# EasyEDA Pro project Smart Coaster_rev1.epro, board Smart Coaster Rev1
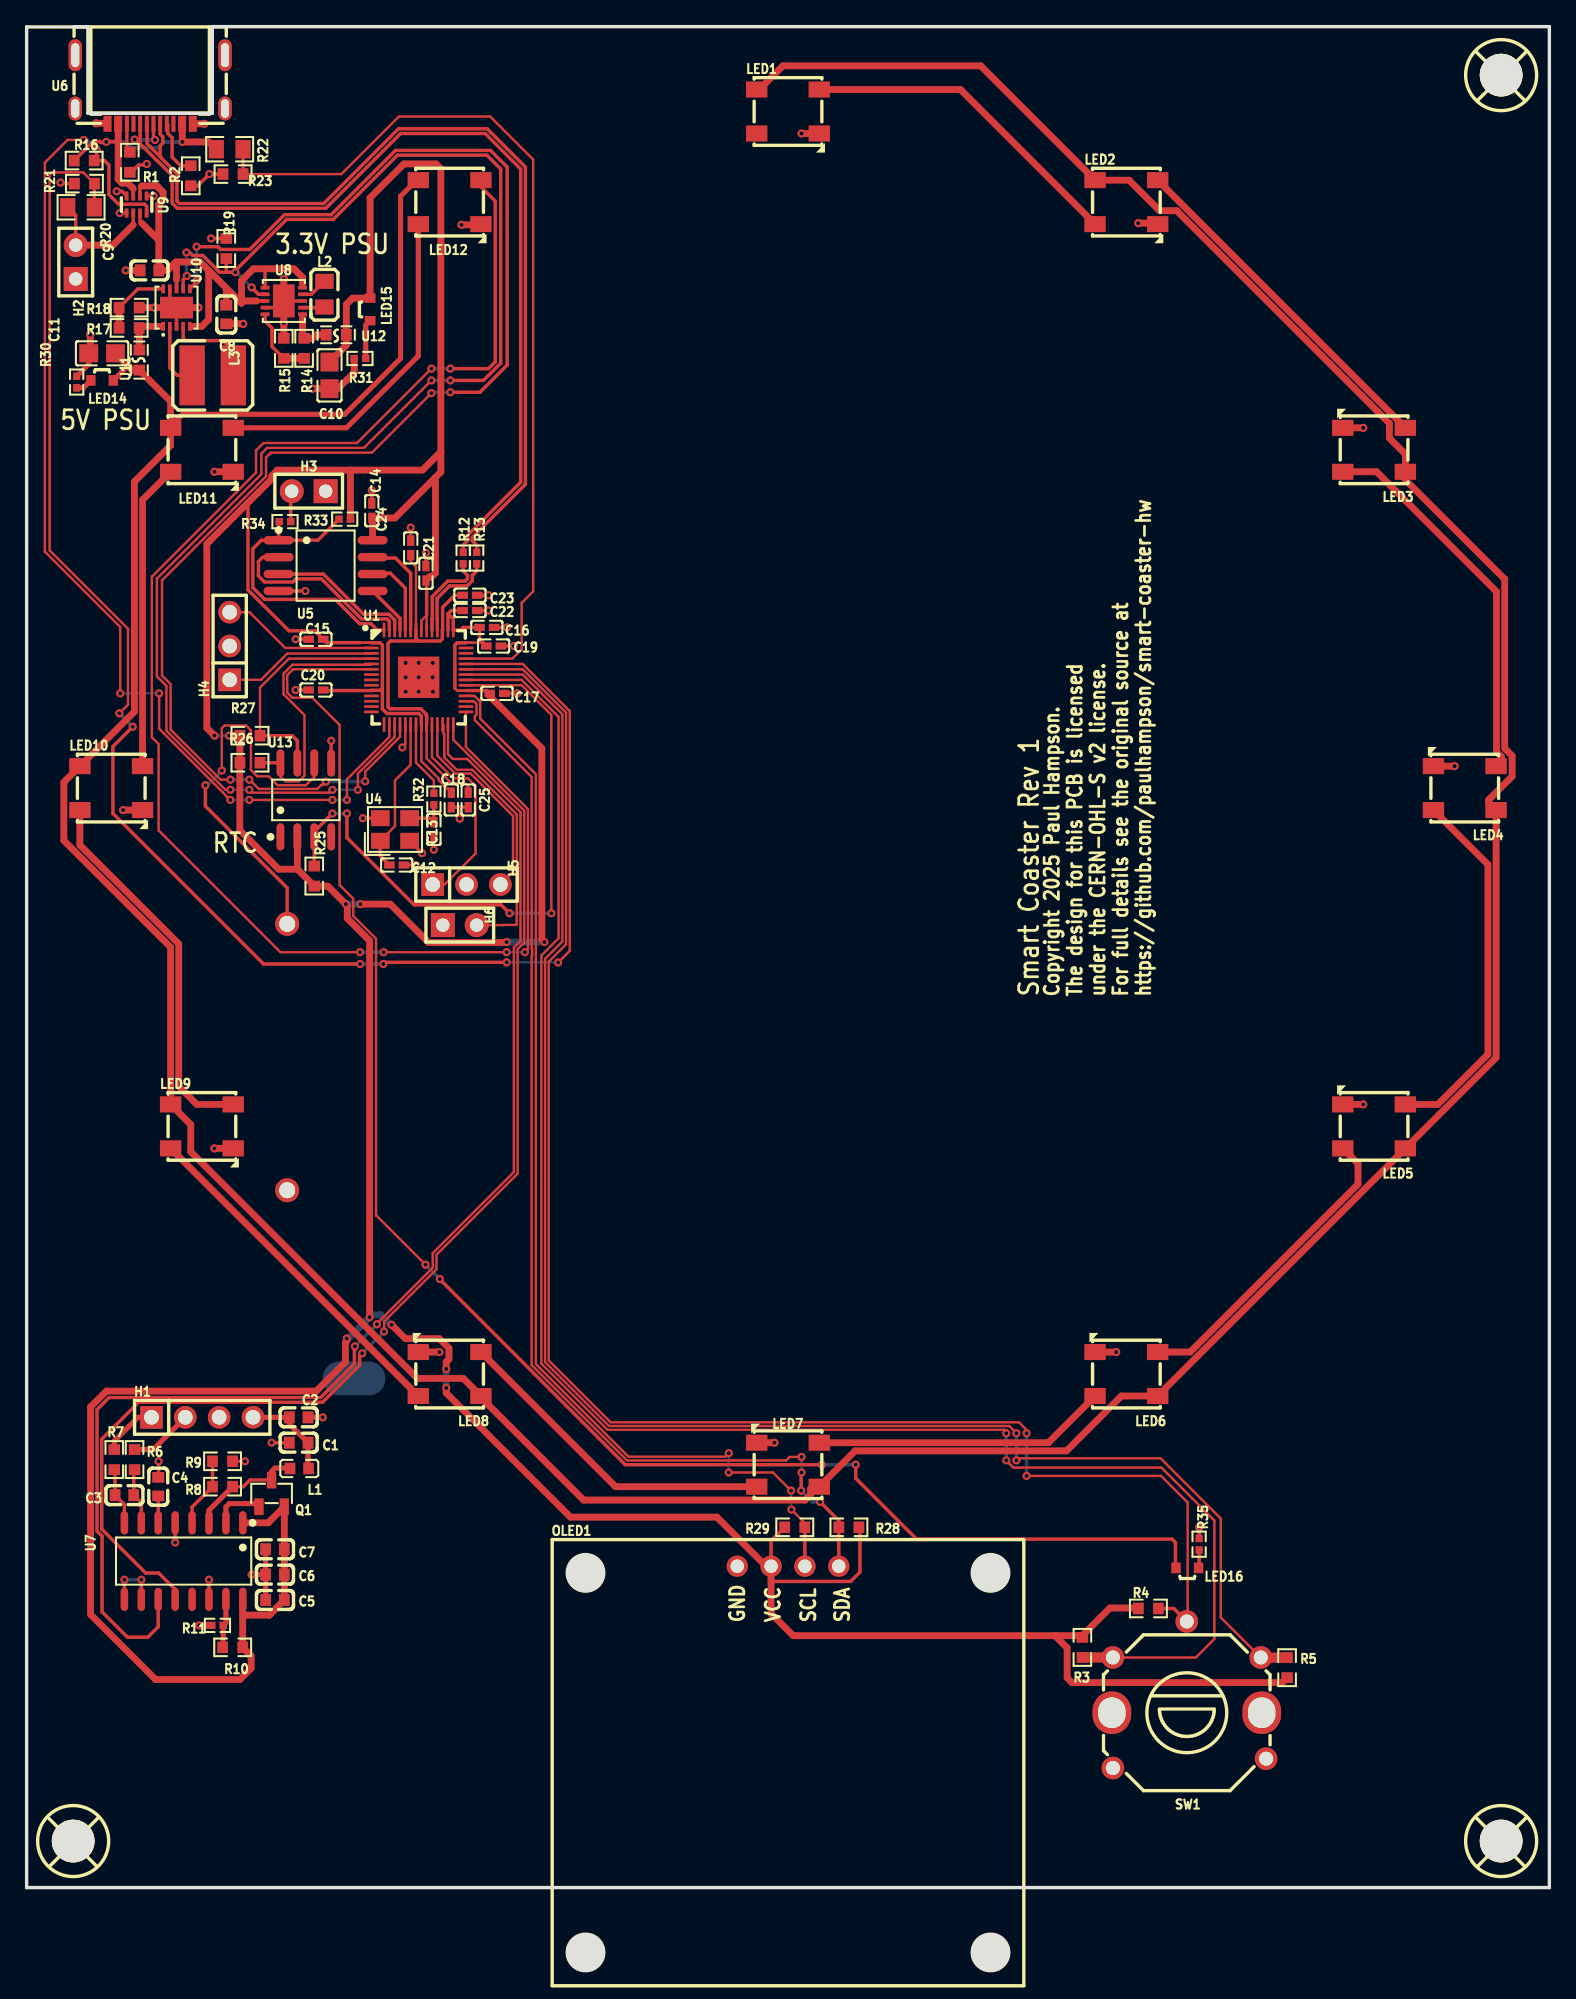
[diagram p5: board, top side]
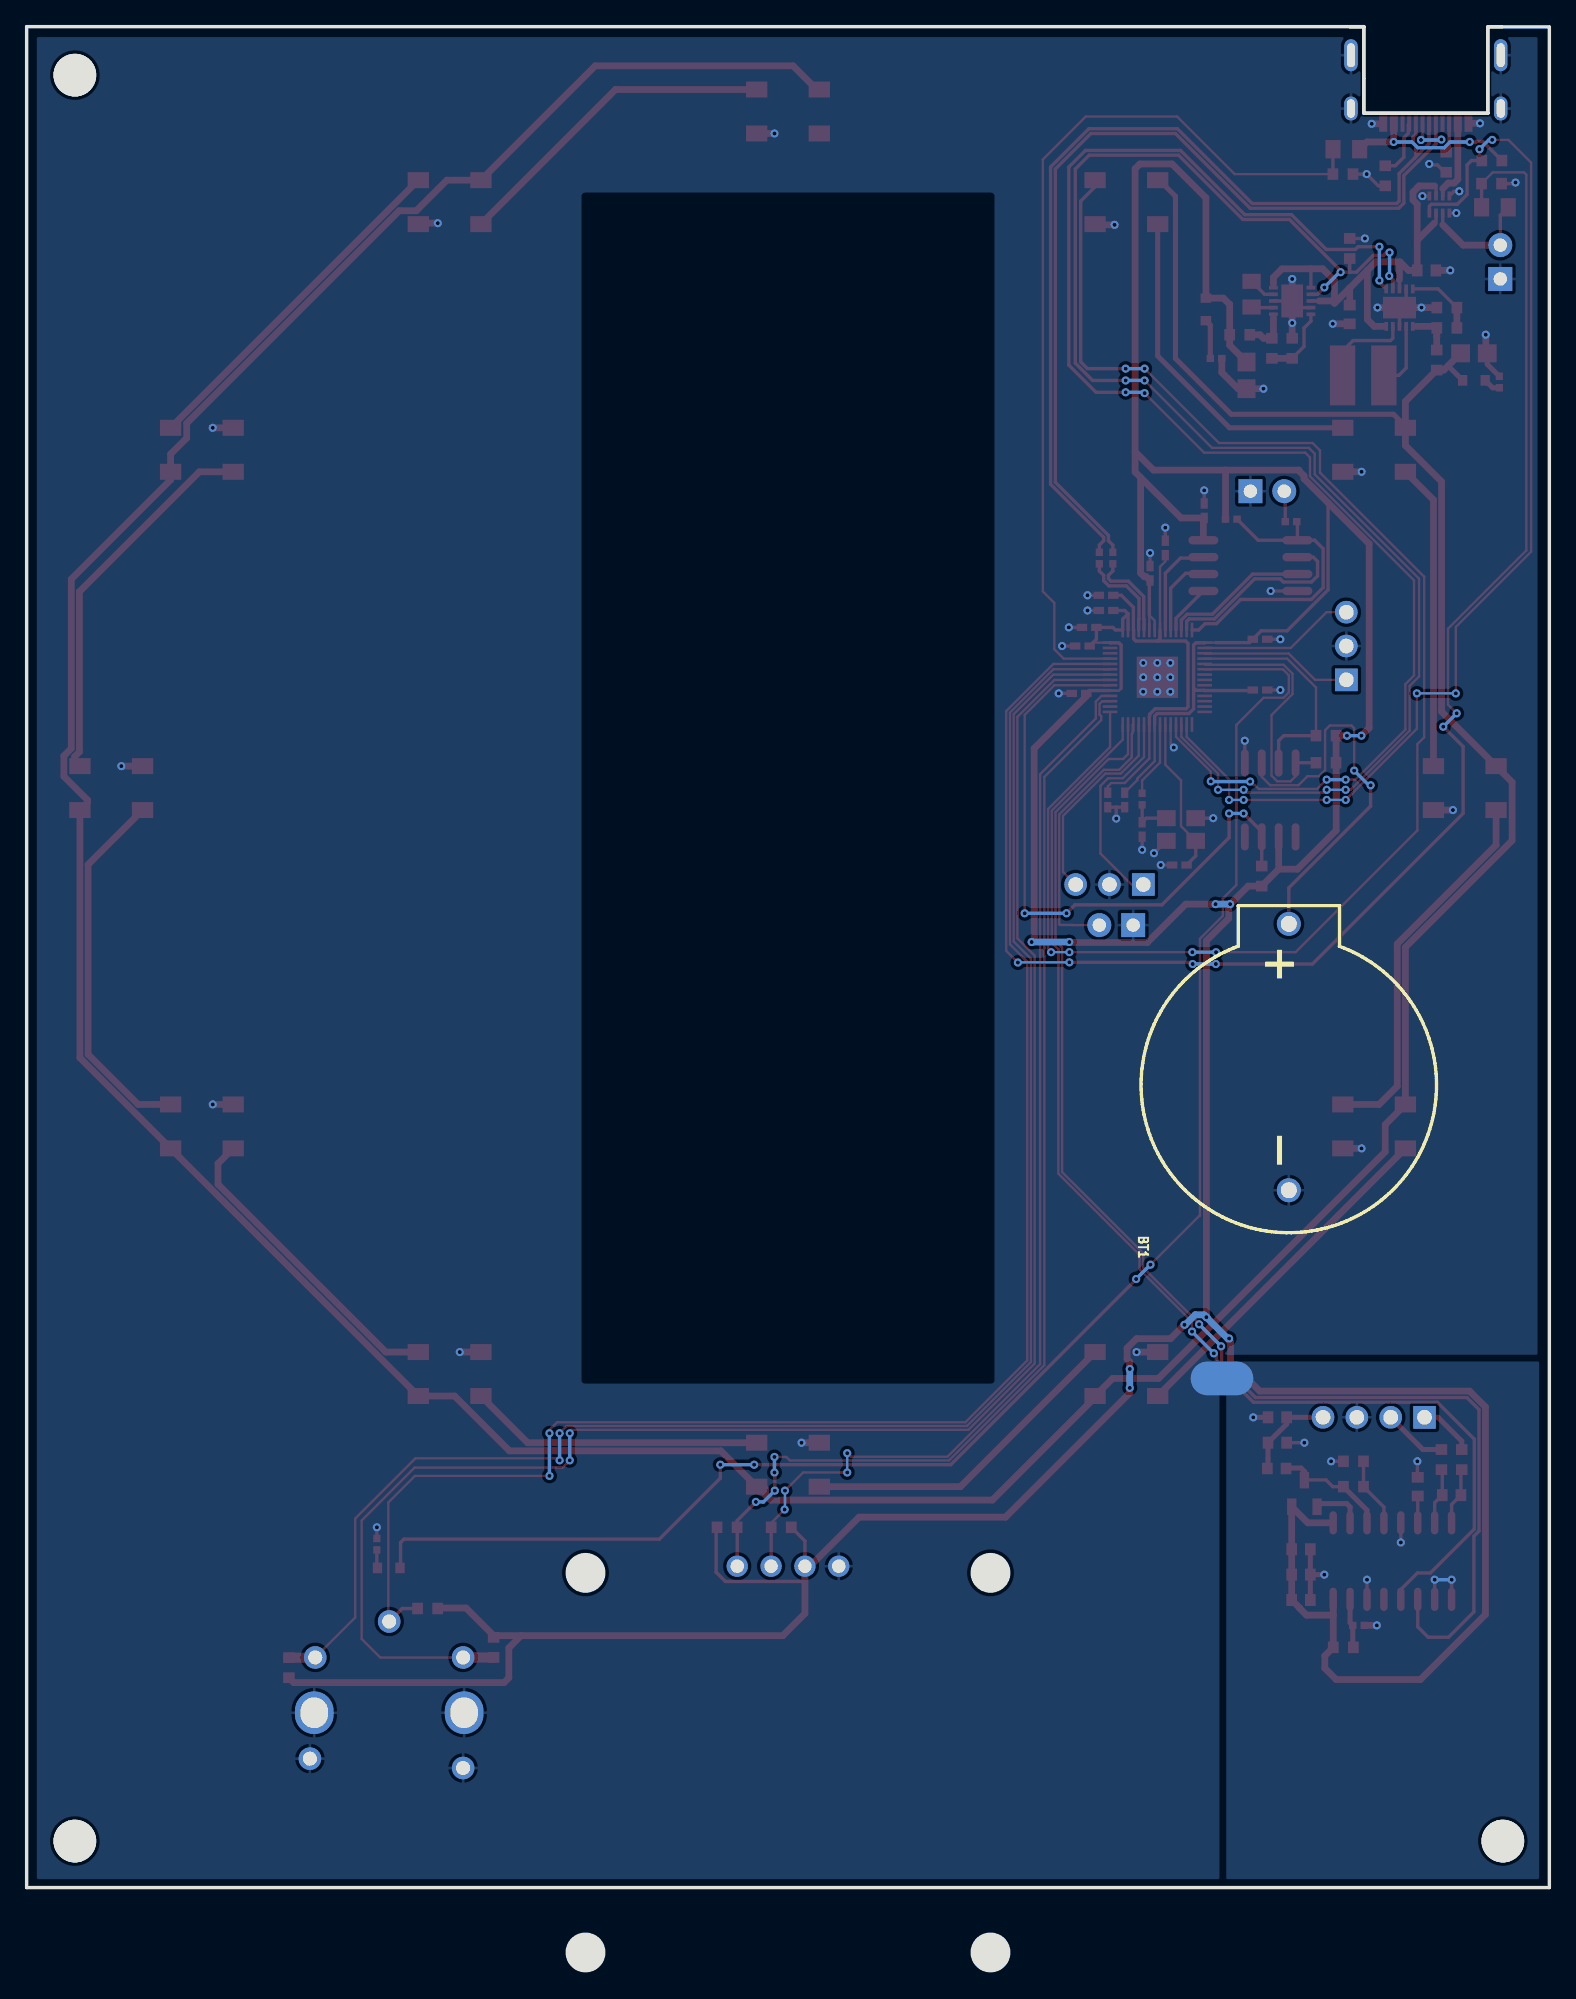
[diagram p6: board, bottom side, seen from below]

Outline 114.3 x 146.09 mm; copper layers: Top Layer, Bottom Layer. Coordinates in mm from the lower left corner of the outline.
Outline path: 0,146.07 4.62,146.07 4.62,139.59 13.92,139.59 13.92,146.09 114.3,146.09 114.3,6.37 0,6.37 0,146.07
Stack: Top Layer 0.035mm / Dielectric1 1.51mm FR4 er 4.5 / Bottom Layer 0.035mm

## Design rules (mm)
net USB_DP: DP1
net $2N848: DP2
net USB_DM: DP1
net $2N853: DP2
template: Custom Config
spacing copperThickness1oz (default): track to track 0.102, other pairs 0.152 to 0.3
spacing copperThickness2oz: track to track 0.203, other pairs 0.152 to 0.3
track width copperThickness1oz (default): min 0.127, default 0.254, max 2.54
track width copperThickness2oz: min 0.203, default 0.254, max 2.54
differential pair differentialPair (default): width min 0.127, default 0.254, max 2.54; gap min 0.102, default 0.102
via viaSize (default): diameter min 0.5, default 0.61, max 10; hole min 0.3, default 0.305, max 6.3

## Placement (name value [footprint] x y rotation side)
BT1  BS-02-A1AK010-X  [BAT-TH_BS-02-A1AJ010]  19.56 68.72 90 bottom
C1  100nF  [C0603]  20.42 39.77 180 top
C2  10uF  [C0603]  20.42 41.67 0 top
C3  100nF  [C0603]  7.34 35.83 180 top
C4  100nF  [C0603]  9.88 36.47 270 top
C5  100nF  [C0603]  18.64 27.96 0 top
C6  100nF  [C0603]  18.64 29.86 0 top
C7  10uF  [C0603]  18.64 31.77 0 top
C8  10uF  [C0603]  14.99 124.48 270 top
C9  10uF  [C0603]  9.22 127.78 180 top
C10  22uF  [C0805]  22.73 119.9 270 top
C11  22uF  [C0805]  5.66 121.56 180 top
C12  15pF  [C0402]  27.77 83.14 0 top
C13  15pF  [C0402]  30.57 85.81 270 top
C14  100nF  [C0402]  25.91 109.74 270 top
C15  100nF  [C0402]  21.72 100.09 0 top
C16  100nF  [C0402]  34.54 100.98 180 top
C17  100nF  [C0402]  35.31 96.03 180 top
C18  100nF  [C0402]  31.88 88.03 90 top
C19  100nF  [C0402]  35.05 99.58 180 top
C20  100nF  [C0402]  21.72 96.28 0 top
C21  100nF  [C0402]  29.97 105.04 270 top
C22  1uF  [C0402]  33.27 102.25 0 top
C23  1uF  [C0402]  33.27 103.39 0 top
C24  100nF  [C0402]  28.83 106.95 270 top
C25  100nF  [C0402]  33.15 88.03 90 top
H1  -  [HDR-TH_4P-P2.54-V-M]  13.18 41.67 0 top
H2  -  [HDR-TH_2P-P2.54-V-M-1]  3.68 128.41 90 top
H3  -  [HDR-TH_2P-P2.54-V-M-1]  21.17 111.21 180 top
H4  -  [HDR-TH_3P-P2.54-V-M]  15.24 99.58 90 top
H5  -  [HDR-TH_3P-P2.54-V-M]  33.02 81.68 0 top
H6  -  [HDR-TH_2P-P2.54-V-M-1]  32.51 78.63 0 top
L1  3.3uH  [L0603]  20.47 37.83 180 top
L2  2.2uH  [L0805]  22.35 126 90 top
L3  3.3uH  [IND-SMD_L4.5-W4.0]  13.97 119.9 0 top
LED1  WS2812E-V5  [LED-SMD_4P-L5.0-W5.0-LS5.4-TL-1]  57.15 139.72 0 top
LED2  WS2812E-V5  [LED-SMD_4P-L5.0-W5.0-LS5.4-TL-1]  82.55 132.91 0 top
LED3  WS2812E-V5  [LED-SMD_4P-L5.0-W5.0-LS5.4-TL-1]  101.14 114.32 180 top
LED4  WS2812E-V5  [LED-SMD_4P-L5.0-W5.0-LS5.4-TL-1]  107.95 88.92 180 top
LED5  WS2812E-V5  [LED-SMD_4P-L5.0-W5.0-LS5.4-TL-1]  101.14 63.52 180 top
LED6  WS2812E-V5  [LED-SMD_4P-L5.0-W5.0-LS5.4-TL-1]  82.55 44.92 180 top
LED7  WS2812E-V5  [LED-SMD_4P-L5.0-W5.0-LS5.4-TL-1]  57.15 38.12 180 top
LED8  WS2812E-V5  [LED-SMD_4P-L5.0-W5.0-LS5.4-TL-1]  31.75 44.92 180 top
LED9  WS2812E-V5  [LED-SMD_4P-L5.0-W5.0-LS5.4-TL-1]  13.16 63.52 0 top
LED10  WS2812E-V5  [LED-SMD_4P-L5.0-W5.0-LS5.4-TL-1]  6.35 88.92 0 top
LED11  WS2812E-V5  [LED-SMD_4P-L5.0-W5.0-LS5.4-TL-1]  13.16 114.32 0 top
LED12  WS2812E-V5  [LED-SMD_4P-L5.0-W5.0-LS5.4-TL-1]  31.75 132.91 0 top
LED14  BL-HUB38E-AV-TRC  [LED-SMD_L1.7-W1.1-RD_RED-SIDE]  5.66 119.53 0 top
LED15  BL-HUB38E-AV-TRC  [LED-SMD_L1.7-W1.1-RD_RED-SIDE]  25.78 124.86 90 top
LED16  BL-HUB38E-AV-TRC  [LED-SMD_L1.7-W1.1-RD_RED-SIDE]  87.12 30.37 180 top
OLED1  HS13L03W2C01  [OLED-TH_L35.4-W33.5_HS13L03W2C01]  57.15 30.5 0 top
Q1  MMBT4403  [SOT-23-3_L2.9-W1.3-P1.90-LS2.4-BR]  18.39 35.96 270 top
R1  56kΩ  [R0603]  7.75 135.91 90 top
R2  56kΩ  [R0603]  12.32 134.89 90 top
R3  5.1kΩ  [R0603]  79.25 24.4 90 top
R4  5.1kΩ  [R0603]  84.2 27.32 180 top
R5  5.1kΩ  [R0603]  94.62 22.88 270 top
R6  100Ω  [R0603]  8.1 38.5 270 top
R7  100Ω  [R0603]  6.58 38.5 270 top
R8  20kΩ  [R0603]  14.7 36.47 0 top
R9  8.2kΩ  [R0603]  14.7 38.37 180 top
R10  DNF_10K  [R0603]  15.47 24.4 0 top
R11  0Ω  [R0402]  14.32 26.05 0 top
R12  27.4Ω  [R0402]  32.77 106.19 90 top
R13  27.4Ω  [R0402]  33.78 106.19 90 top
R14  487kΩ  [R0603]  20.83 121.94 270 top
R15  86.6kΩ  [R0603]  19.3 121.94 90 top
R16  10kΩ  [R0603]  4.32 136.03 180 top
R17  887kΩ  [R0603]  7.69 123.47 180 top
R18  100kΩ  [R0603]  7.69 124.99 0 top
R19  100kΩ  [R0603]  14.99 129.43 270 top
R20  5.6kΩ  [R0805]  4.09 132.52 180 top
R21  10kΩ  [R0603]  4.34 134.3 0 top
R22  5.6kΩ  [R0805]  15.24 136.88 180 top
R23  10kΩ  [R0603]  15.49 135.02 0 top
R25  5.1kΩ  [R0603]  21.59 82.31 270 top
R26  5.1kΩ  [R0603]  16.76 90.82 180 top
R27  5.1kΩ  [R0603]  16.76 92.85 180 top
R28  DNF_5.1K  [R0603]  61.72 33.42 0 top
R29  DNF_5.1K  [R0603]  57.66 33.42 180 top
R30  2.8kΩ  [R0402]  3.76 119.4 270 top
R31  806Ω  [R0402]  25.02 121.17 0 top
R32  1kΩ  [R0402]  30.57 88.09 90 top
R33  10kΩ  [R0402]  23.88 109.11 0 top
R34  10kΩ  [R0402]  19.39 108.92 0 top
R35  470Ω  [R0402]  88.01 32.15 270 top
SCREW1  -  [Screw-Hole-M3]  3.56 9.79 0 top
SCREW2  -  [Screw-Hole-M3]  110.74 142.38 0 top
SCREW3  -  [Screw-Hole-M3]  110.74 9.79 0 top
SW1  EC12D1524403  [SW-TH_EC12D1524403]  87.25 20.84 0 top
U1  RP2040  [LQFN-56_L7.0-W7.0-P0.4-EP]  29.43 97.24 0 top
U4  ABM8-272-T3  [CRYSTAL-SMD_4P-L3.2-W2.5-BL]  27.65 85.81 0 top
U5  W25Q128JVSIQ  [SOIC-8_L5.3-W5.3-P1.27-LS8.0-BL]  22.44 105.62 270 top
U6  TYPE C-DB-110PWB  [USB-C-SMD_TYPE-C-DB-111PWB]  9.27 141.37 180 top
U7  HX711  [SOP-16_L10.0-W3.9-P1.27-LS6.0-BL]  11.78 30.88 180 top
U8  RT6150AGQW  [WDFN-10_L3.0-W3.0-P0.50-BL-EP]  19.3 125.49 90 top
U9  LM66200DRLR  [SOT-583-8_L2.1-W1.2-P0.50-LS1.6-BL]  8.26 132.73 180 top
U10  RT6150AGQW  [WDFN-10_L3.0-W3.0-P0.50-BL-EP]  11.25 124.99 0 top
U11  0467.250NRHF  [F0603]  8.46 121.05 270 top
U12  0467.250NRHF  [F0603]  23.24 122.95 0 top
U13  DS3231MZ+TRL  [SOIC-8_L4.9-W3.9-P1.27-LS6.0-BL]  20.96 88.03 0 top

## Footprints (pads in the part's own frame, mm; a bottom-side part is the same pattern mirrored in y, then rotated)
BAT-TH_BS-02-A1AJ010
  round 1.8 hole 1.2: 1(-10,0) 2(10,0)
C0402
  rect 0.79x0.54 smd: 1(-0.545,0) 2(0.545,0)
C0603
  rect 0.8x0.9 smd: 1(-0.7,0) 2(0.7,0)
C0805
  rect 1.41x1.35 smd: 1(-1,0) 2(1,0)
CRYSTAL-SMD_4P-L3.2-W2.5-BL
  rect 1.4x1.2 smd: 1(-1.1,-0.85) 2(1.1,-0.85) 3(1.1,0.85) 4(-1.1,0.85)
F0603
  rect 0.806x0.864 smd: 1(-0.753,0) 2(0.753,0)
HDR-TH_2P-P2.54-V-M-1
  rect 1.8x1.8 hole 1: 1(-1.27,0)
  round 1.8 hole 1: 2(1.27,0)
HDR-TH_3P-P2.54-V-M
  rect 1.7x1.7 hole 1.1: 1(-2.54,0)
  round 1.7 hole 1.1: 2(0,0) 3(2.54,0)
HDR-TH_4P-P2.54-V-M
  rect 1.7x1.7 hole 1.1: 1(-3.81,0)
  round 1.7 hole 1.1: 2(-1.27,0) 3(1.27,0) 4(3.81,0)
IND-SMD_L4.5-W4.0
  rect 1.9x4.5 smd: 1(-1.55,0) 2(1.55,0)
L0603
  rect 0.8x0.864 smd: 1(-0.7,0) 2(0.7,0)
L0805
  rect 1.133x1.377 smd: 1(-0.966,0) 2(0.966,0)
LED-SMD_4P-L5.0-W5.0-LS5.4-TL-1
  rect 1.6x1.2 smd: 1(-2.35,1.65) 2(-2.35,-1.65) 3(2.35,-1.65) 4(2.35,1.65)
LED-SMD_L1.7-W1.1-RD_RED-SIDE
  rect 0.7x0.8 smd: 1(-0.847,0) 2(0.847,0)
LQFN-56_L7.0-W7.0-P0.4-EP
  rect 1.1x0.2 smd: 1(-3.55,2.6) 2(-3.55,2.2) 3(-3.55,1.8) 4(-3.55,1.4) 5(-3.55,1) 6(-3.55,0.6) 7(-3.55,0.2) 8(-3.55,-0.2) 9(-3.55,-0.6) 10(-3.55,-1) 11(-3.55,-1.4) 12(-3.55,-1.8) 13(-3.55,-2.2) 14(-3.55,-2.6) 29(3.55,-2.6) 30(3.55,-2.2) 31(3.55,-1.8) 32(3.55,-1.4) 33(3.55,-1) 34(3.55,-0.6) 35(3.55,-0.2) 36(3.55,0.2) 37(3.55,0.6) 38(3.55,1) 39(3.55,1.4) 40(3.55,1.8) 41(3.55,2.2) 42(3.55,2.6)
  rect 0.2x1.1 smd: 15(-2.6,-3.55) 16(-2.2,-3.55) 17(-1.8,-3.55) 18(-1.4,-3.55) 19(-1,-3.55) 20(-0.6,-3.55) 21(-0.2,-3.55) 22(0.2,-3.55) 23(0.6,-3.55) 24(1,-3.55) 25(1.4,-3.55) 26(1.8,-3.55) 27(2.2,-3.55) 28(2.6,-3.55) 43(2.6,3.55) 44(2.2,3.55) 45(1.8,3.55) 46(1.4,3.55) 47(1,3.55) 48(0.6,3.55) 49(0.2,3.55) 50(-0.2,3.55) 51(-0.6,3.55) 52(-1,3.55) 53(-1.4,3.55) 54(-1.8,3.55) 55(-2.2,3.55) 56(-2.6,3.55)
  rect 3.1x3.1 smd: 57(0,0)
OLED-TH_L35.4-W33.5_HS13L03W2C01
  round 1.6 hole 1: 1(-3.81,0) 2(-1.27,0) 3(1.27,0) 4(3.81,0)
R0402
  rect 0.566x0.54 smd: 1(-0.433,0) 2(0.433,0)
R0603
  rect 0.806x0.864 smd: 1(-0.753,0) 2(0.753,0)
R0805
  rect 1.133x1.377 smd: 1(-1,0) 2(1,0)
Screw-Hole-M3
  round 3.2 hole 3.2: 1(-0.064,0.064)
SOIC-8_L4.9-W3.9-P1.27-LS6.0-BL
  oval 0.588x2.045 smd: 1(-1.905,-2.772) 2(-0.635,-2.772) 3(0.635,-2.772) 4(1.905,-2.772) 5(1.905,2.772) 6(0.635,2.772) 7(-0.635,2.772) 8(-1.905,2.772)
SOIC-8_L5.3-W5.3-P1.27-LS8.0-BL
  oval 0.63x2.25 smd: 1(-1.905,-3.53) 2(-0.635,-3.53) 3(0.635,-3.53) 4(1.905,-3.53) 5(1.905,3.53) 6(0.635,3.53) 7(-0.635,3.53) 8(-1.905,3.53)
SOP-16_L10.0-W3.9-P1.27-LS6.0-BL
  oval 0.56x1.745 smd: 1(-4.445,-2.873) 2(-3.175,-2.873) 3(-1.905,-2.873) 4(-0.635,-2.873) 5(0.635,-2.873) 6(1.905,-2.873) 7(3.175,-2.873) 8(4.445,-2.873) 9(4.445,2.873) 10(3.175,2.873) 11(1.905,2.873) 12(0.635,2.873) 13(-0.635,2.873) 14(-1.905,2.873) 15(-3.175,2.873) 16(-4.445,2.873)
SOT-23-3_L2.9-W1.3-P1.90-LS2.4-BR
  rect 1.25x0.7 smd: 1(1,-0.95) 2(1,0.95) 3(-1,0)
SOT-583-8_L2.1-W1.2-P0.50-LS1.6-BL
  rect 0.28x0.68 smd: 1(-0.75,-0.64) 2(-0.25,-0.64) 3(0.25,-0.64) 4(0.75,-0.64) 5(0.75,0.64) 6(0.25,0.64) 7(-0.25,0.64) 8(-0.75,0.64)
SW-TH_EC12D1524403
  oval 2.9x3.2 hole 2.05x2.3: 6(-5.788,-1.35) 7(5.462,-1.35)
  round 1.7 hole 1.05: A(-5.713,2.8) B(5.387,2.8) C(-5.713,-5.5) D(5.788,-4.8) E(-0.163,5.5)
USB-C-SMD_TYPE-C-DB-111PWB
  oval 1x1.8 hole 0.6x1.4: 13(5.62,1.425) 14(-5.62,1.425)
  oval 1x2.4 hole 0.6x1.8: 13(5.62,-2.575) 14(-5.62,-2.575)
  rect 0.6x1.2 smd: A1B12(-3.2,2.575) A4B9(-2.4,2.575) B1A12(3.2,2.575) B4A9(2.4,2.575)
  rect 0.3x1.2 smd: A5(-1.25,2.575) A6(-0.25,2.575) A7(0.25,2.575) A8(1.25,2.575) B5(1.75,2.575) B6(0.75,2.575) B7(-0.75,2.575) B8(-1.75,2.575)
WDFN-10_L3.0-W3.0-P0.50-BL-EP
  rect 0.28x0.665 smd: 1(-1,-1.407) 2(-0.5,-1.407) 3(0,-1.407) 4(0.5,-1.407) 5(1,-1.407) 6(1,1.407) 7(0.5,1.407) 8(0,1.407) 9(-0.5,1.407) 10(-1,1.407)
  rect 2.475x1.625 smd: 11(0,0)

## Nets
As in the schematic.

Pads without a net: LED1 2; SCREW1 1; SCREW2 1; SCREW3 1; U1 7 8 9 11 12 13 14 15 30 40 41; U6 A8 B8; U7 13; U13 1 4

## Via types
v1: diameter 0.61, hole 0.305, Top Layer to Bottom Layer, 148 vias

## Routing (per net, layer and track width the routed paths; a pad name or vN(x,y) marks a point on that pad's centre or on a via; arc(x,y) is an arc through that point)
1V1: length 30.8
  Top Layer w0.178: C24.2 28.83,105.93 29.23,105.54 U1.50 ; U1.23 30.03,91.14 31.87,89.3 32.89,89.3 33.15,89.04 C25.2
  Top Layer w0.254: U1.50 29.23,100.14 29.41,99.96 ; C23.1 32.13,103.39 31.23,102.49 U1.45 31.2,100.77 31.2,100.12 31.04,99.96 29.41,99.96 ; 29.41,99.96 27.31,99.96 27.13,99.78 27.13,95.01 27.26,94.87 29.59,94.87 30,94.46 30,94.33 30.03,94.31 U1.23
3V3: length 428.6
  Top Layer w0.178: U1.49 29.63,101.49 30.03,101.89 U1.48 ; U1.22 29.63,90.94 30.92,89.64 30.92,89.52 C18.2 ; U1.33 32.97,96.23 32.31,96.23 32.15,96.39 ; 25.04,99.84 25.88,99.84 ; U1.42 34.25,99.84
  Top Layer w0.254: 25.88,99.84 25.9,99.82 26.54,99.82 26.7,99.65 26.7,96.42 ; 26.7,96.42 26.7,94.86 27.05,94.52 29.44,94.52 29.63,94.33 U1.22 ; 26.7,96.42 26.54,96.26 25.9,96.26 25.88,96.24 22.31,96.24 C20.2 ; R29.2 55.88,32.39 OLED1.2 ; 30.03,101.89 30.03,104.45 C21.2 ; U1.33 34.55,96.24 C17.2 ; 31.63,102 32.03,101.6 U1.43 32.57,100.79 32.77,100.98 C16.2 34,100.09 C19.2 ; 31.63,102 31.88,102.25 C22.1 ; 31.63,102 U1.44 ; 16.61,110.34 16.61,103.8 19.69,100.73 21.63,100.73 C15.2 22.52,99.84 25.04,99.84 ; U1.42 32.95,99.82 32.31,99.82 32.15,99.65 32.15,96.39 ; 55.88,29.27 55.97,29.35 61.85,29.35 62.55,30.05 62.55,33.34 R28.2
  Top Layer w0.508: U5.8 25.97,109.14 C14.2 27.64,109.2 30.61,112.16 ; v1(24.04,47.59) 24.04,47.41 23.93,47.3 23.93,45.83 21.74,43.64 5.99,43.64 4.8,42.45 4.8,26.87 9.68,21.99 16,21.99 16.85,22.84 16.85,23.77 R10.2 16.22,26.82 ; C17.2 34.76,95.81 38.67,91.9 38.67,77.55 v1(38.86,77.36) ; 77.19,25.28 78.11,24.36 78.11,22.11 78.46,21.75 94.25,21.75 R5.2 ; 77.19,25.28 57.54,25.28 55.88,26.94 OLED1.2 55.5,30.5 51.82,34.18 40.82,34.18 31.5,43.5 v1(31.5,43.88) ; 77.19,25.28 79.12,25.28 R3.2 79.25,25.29 81.32,27.36 83.41,27.36 R4.2 ; 16.22,26.82 18.23,26.82 18.75,27.34 18.75,27.36 C5.2 C6.2 C7.2 19.34,34.95 Q1.2 18.13,33.75 U7.1 ; 16.22,26.82 16.22,28 U7.16 ; 24.31,112.79 24.31,109.11 R33.2 ; 24.31,112.79 18.8,112.79 18.8,112.75 18.42,112.36 18.42,112.14 16.61,110.34 13.53,107.25 13.53,93.43 v1(14.1,92.85) ; 24.31,112.79 29.71,112.79 31.09,114.17 ; v1(25.75,49.19) 25.75,77.46 24.07,79.14 24.07,80.1 v1(23.96,80.2) 22.61,81.56 R25.2 20.32,82.83 ; v1(25.06,80.2) 27.29,80.2 30.17,77.32 35.99,77.32 v1(36.03,77.36) ; v1(15.2,92.85) R27.2 R26.2 16,90.81 16,85.74 18.91,82.83 20.32,82.83 ; C21.2 30.26,104.79 30.41,104.79 30.68,105.06 30.68,112.24 31.09,112.65 31.09,114.17 ; 20.32,82.83 U13.2 ; v1(27.39,48.62) 28.44,47.58 30.99,47.58 31.7,46.87 31.7,46.04 31.5,45.84 v1(31.5,45.3) ; 31.09,114.17 31.09,135.42 30.73,135.78 28.32,135.78 25.78,133.24 LED15.2 24.47,125.7 23.99,125.23 U12.2 23.99,122.16 C10.1
  Bottom Layer w0.254: v1(15.2,92.85) v1(14.1,92.85)
  Bottom Layer w0.508: v1(27.39,48.62) 27.33,48.62 26.58,49.37 25.92,49.37 v1(25.75,49.19) 24.15,47.59 v1(24.04,47.59) ; v1(23.96,80.2) v1(25.06,80.2) ; v1(31.5,43.88) v1(31.5,45.3) ; v1(36.03,77.36) v1(38.86,77.36)
+5V: length 338.8
  Top Layer w0.381: LED14.2 7.59,120.61 7.61,120.61 ; 10.81,116.09 11.7,116.98 23.88,116.98 28.07,121.17 28.07,133.35 29.27,134.56 LED12.1
  Top Layer w0.508: C11.1 7.61,120.61 7.92,120.3 U11.2 10.81,117.95 LED11.1 10.81,114.64 8.09,111.92 8.09,94.66 LED10.1 2.79,89.36 2.79,84.98 10.81,76.97 LED9.1 12.32,63.65 12.32,61.61 29.34,44.59 32.78,44.59 LED8.1 34.1,43.17 41.81,35.46 58.43,35.46 58.85,35.88 58.85,36.32 58.99,36.47 LED7.1 62.19,39.16 78.06,39.16 82.17,43.27 LED6.1 LED5.1 110.3,68.67 LED4.1 109.74,87.82 109.74,88.03 111.51,89.8 111.51,91.33 110.95,91.89 110.95,104.6 103.49,112.06 LED3.1 103.49,113.99 102.29,115.2 102.29,116.31 86.33,132.27 85.05,132.27 82.75,134.56 LED2.1 71.62,143.14 56.77,143.14 54.99,141.37 LED1.1
GND: length 95.7
  Top Layer w0.178: U1.19 28.43,92.19 v1(28.19,91.96)
  Top Layer w0.254: R9.1 v1(16.38,38.37) ; C20.1 v1(20.19,96.28) ; C16.1 v1(36.07,100.98) ; C4.1 9.91,37.19 v1(9.91,38.37) ; 30.57,85.26 v1(30.57,84.28) ; U8.9 18.8,124.99 U8.11 U8.3 ; U7.5 v1(11.15,32.28) ; C15.1 v1(20.19,100.09) ; C19.1 v1(36.58,99.58) ; U9.4 7.15,133.72 v1(6.76,133.72) ; C17.1 v1(36.83,96.03) ; C23.2 v1(34.67,103.39) ; v1(2.54,134.38) 2.62,134.3 R21.1 ; U13.5 v1(22.86,92.47) ; 32.49,87.48 C25.1 ; 32.49,87.48 32.51,87.46 v1(32.51,86.63) ; 32.49,87.48 C18.1 ; U4.4 v1(25.23,86.66) ; U7.10 v1(8.61,29.48) ; C24.1 v1(28.83,108.47) ; R1.1 7.85,135.15 8.4,135.7 8.94,135.7 v1(9.02,135.78) ; v1(7.34,29.48) U7.9 ; C21.1 v1(29.97,106.57) ; R2.1 12.84,134.14 v1(13.72,135.02) R23.1 ; 19.72,39.77 v1(18.39,39.77) ; U9.1 9.01,133.37 v1(9.53,133.37) ; C22.2 v1(34.67,102.25) ; U9.5 v1(6.98,132.09) ; R35.1 v1(88.01,33.42) ; R19.1 v1(13.84,130.18) ; C12.2 v1(29.17,83.14) ; U10.3 U10.11 10.75,125.49 U10.9 ; U4.2 29.68,84.03 v1(29.68,84.03) ; C14.1 v1(25.91,111.27) ; 18.91,103.71 v1(20.92,103.71) ; U7.14 v1(13.69,29.48)
  Top Layer w0.381: C6.1 C7.1 ; C6.1 v1(16.89,29.86) ; C6.1 C5.1 ; C11.2 4.66,120.74 R30.1 ; C2.2 21.12,41.67 v1(22.23,41.67)
  Top Layer w0.508: v1(4.77,122.96) 4.77,121.67 C11.2 ; v1(5.21,138.83) 6.04,138.83 U6.B1A12 ; LED1.3 v1(58.17,138.07) ; LED6.3 v1(81.79,46.57) ; LED10.3 v1(7.24,87.27) ; v1(21.46,118.9) C10.2 23.37,118.9 24.59,120.12 R31.1 ; LED3.3 v1(100.33,115.97) ; R11.1 12.96,26.05 v1(12.95,26.05) ; v1(12.9,124.99) U10.11 v1(9.6,124.99) R18.2 ; LED11.3 v1(14.1,112.67) ; LED5.3 v1(100.33,65.17) ; LED4.3 v1(107.19,90.57) ; LED2.3 84.83,131.33 v1(83.44,131.33) ; C9.2 v1(7.44,127.78) ; v1(19.3,127.14) U8.11 v1(19.3,123.84) R15.2 ; LED7.3 v1(56.13,39.77) ; LED8.3 v1(30.99,46.57) ; v1(32.64,131.21) 34.05,131.21 LED12.3 ; U6.A1B12 v1(13.34,138.79) ; C8.2 v1(16.26,123.78) ; LED9.3 v1(14.1,61.87)
  Bottom Layer w0.254: v1(8.61,29.48) v1(7.34,29.48)
  Bottom Layer w2.54: 23.5,44.59 25.65,44.59
  vias: v1(28.45,98.31) v1(28.45,97.24) v1(28.45,96.15) v1(29.43,98.32) v1(29.43,97.24) v1(29.43,96.15) v1(30.48,98.31) v1(30.48,97.24) v1(30.49,96.15)
VBAT: length 8.9
  Top Layer w0.254: U9.6 8.01,131.21 ; H2.2 3.68,131.93 R20.2
  Top Layer w0.508: 8,131.21 6.48,129.68 H2.2
VBAT_MON: length 123.9
  Top Layer w0.178: R21.2 4.25,135.14 1.91,135.14 1.73,134.96 1.73,106.76 7.61,100.88 7.61,95.18 v1(6.96,94.53) ; v1(39.89,75.82) 40.77,76.69 40.77,94.7 37.23,98.24 U1.38
  Top Layer w0.254: v1(25.03,75.71) 17.78,75.71 6.48,87.01 6.48,92.04 v1(7.96,93.52) ; R20.1 5.09,134.29 R21.2 ; v1(36.03,75.83) 26.9,75.83 v1(26.77,75.71)
  Bottom Layer w0.178: v1(36.03,75.83) 39.88,75.83 v1(39.89,75.82)
  Bottom Layer w0.254: v1(26.77,75.71) v1(25.03,75.71) ; v1(7.96,93.52) v1(6.96,94.53)
VBUS: length 20.4
  Top Layer w0.254: 6.02,137.43 v1(5.98,137.43) ; 6.02,137.43 6.11,137.52 6.17,137.46 6.81,137.46 6.87,137.52 ; 6.02,137.43 5.98,137.39 5.56,137.39 5.48,137.47 5,137.47 R16.2 ; 8,133.87 8,133.37 U9.3
  Top Layer w0.508: U6.B4A9 6.87,134.62 7.15,134.34 7.59,134.34 8.01,133.92 ; U6.A4B9 11.68,138.78 v1(11.68,137.43) 13.69,137.43 R22.2
  Bottom Layer w0.254: v1(5.98,137.43) 7.46,137.43 7.89,136.99 9.88,136.99 10.31,137.43 v1(11.68,137.43)
VBUS_MON: length 68.4
  Top Layer w0.178: R23.2 23.62,135.02 27.94,139.33 34.8,139.33 38.02,136.11 38.02,103.68 37.16,102.82 37.16,99.34 36.46,98.64 U1.39
  Top Layer w0.254: R22.1 16.25,136.88 R23.2
ENC_A: length 133
  Top Layer w0.178: 81.79,23.64 81.8,23.64 87.76,23.64 89.15,25.03 89.15,33.92 85.18,37.9 74.07,37.9 73.75,38.22 73.75,38.23 v1(73.53,38.44) ; v1(73.53,40.48) 73.53,40.6 73.4,40.73 43.61,40.73 38.63,45.71 38.63,76.34 39.93,77.64 39.93,94.26 37.15,97.04 U1.35
  Top Layer w0.762: R3.1 79.25,23.64 SW1.A
  Bottom Layer w0.254: v1(73.53,40.48) v1(73.53,38.44)
ENC_B: length 128.2
  Top Layer w0.178: v1(74.29,38.44) 74.45,38.6 85.11,38.6 89.64,34.07 89.64,26.64 SW1.B ; v1(74.3,40.48) 74.3,40.49 73.76,41.02 43.72,41.02 38.91,45.82 38.91,76.1 40.21,77.39 40.21,94.47 37.24,97.44 U1.36
  Top Layer w0.762: SW1.B 92.65,23.63 R5.1
  Bottom Layer w0.254: v1(74.29,40.48) v1(74.29,38.44)
ENC_SW: length 123.9
  Top Layer w0.178: U1.37 37.23,97.84 40.49,94.58 40.49,77.19 39.19,75.89 39.19,45.94 43.83,41.3 74.48,41.3 75.06,40.73 v1(75.06,40.48) ; 87.02,26.41 87.15,26.53 87.15,35.28 85.15,37.28 v1(75.06,37.28)
  Top Layer w0.254: R4.1 86.11,27.32 87.02,26.41 SW1.E
  Bottom Layer w0.254: v1(75.06,40.48) v1(75.06,37.28)
FLASH_CLK: length 6.1
  Top Layer w0.254: U5.6 26.03,105.04 27.31,105.04 28.43,103.92 U1.52
FLASH_SD0: length 3.8
  Top Layer w0.254: 25.97,103.71 28.03,101.66 U1.53
FLASH_SD1: length 14.8
  Top Layer w0.254: U5.2 17.72,106.25 17.4,105.93 17.4,104.85 17.85,104.39 19.97,104.39 20.2,104.63 22.12,104.63 25.14,101.62 27.04,101.62 27.23,101.43 U1.55
FLASH_SD2: length 10.9
  Top Layer w0.254: U1.54 27.63,101.54 27.19,101.97 25.28,101.97 22.27,104.98 U5.3
FLASH_SD3: length 7.6
  Top Layer w0.254: U5.7 26.04,106.19 27.69,106.19 28.83,105.05 U1.51
FLASH_SS: length 22.9
  Top Layer w0.254: R33.1 21.86,107.52 U5.1 ; U5.1 17.61,107.52 16.98,106.89 16.98,103.97 17.87,103.08 23.17,103.08 24.99,101.26 25.84,101.26 26.32,100.79 U1.56 ; U5.1 18.91,108.87 R34.1
LED_DATA: length 118.1
  Top Layer w0.178: v1(25.02,76.6) 19.05,76.6 9.91,85.74 9.91,92.22 9.4,92.73 9.4,104.79 9.4,104.79 17.2,112.58 17.22,112.58 17.22,114.27 17.23,114.27 17.77,114.82 24.79,114.82 v1(30.38,120.41) ; v1(36.03,76.6) v1(26.8,76.6) ; v1(37.4,76.6) 37.63,76.82 37.63,87.34 32.98,92 U1.29
  Top Layer w0.254: LED12.4 34.1,134.06 35.18,132.98 35.18,120.92 34.67,120.41 v1(31.8,120.41)
  Bottom Layer w0.178: v1(37.4,76.6) v1(36.03,76.6)
  Bottom Layer w0.254: v1(31.8,120.41) v1(30.38,120.41) ; v1(26.8,76.6) v1(25.02,76.6)
LED_PS_EN: length 112.2
  Top Layer w0.178: v1(15.29,89.55) 14.56,89.55 10.81,93.3 10.81,96.72 10.16,97.37 10.16,104.52 17.97,112.33 17.97,113.75 18.33,114.1 25.91,114.1 v1(30.38,118.57) ; v1(16.71,89.55) 16.72,89.55 17.42,88.85 21.82,88.85 22.12,89.15 22.21,89.15 v1(22.46,89.41) ; v1(25.41,89.42) 25.41,90.15 28.03,92.77 U1.18
  Top Layer w0.254: v1(12.76,127.02) 12.76,126.91 U10.6 ; v1(12.76,129.56) 14.36,129.56 14.57,129.36 16.75,129.36 19.36,131.97 22.86,131.97 27.69,136.79 34.82,136.79 36.07,135.54 36.07,120.67 34.03,118.63 v1(31.8,118.63)
  Bottom Layer w0.254: v1(15.29,89.55) v1(16.71,89.55) ; v1(25.41,89.42) 25.4,89.41 v1(22.46,89.41) ; v1(31.8,118.63) 30.44,118.63 v1(30.38,118.57) ; v1(12.76,127.02) v1(12.76,129.56)
LOADCELL_CLK: length 99.5
  Top Layer w0.178: U1.27 31.63,91.47 31.99,91.1 33.08,91.1 37.07,87.11 37.07,77.44 36.58,76.95 36.58,60.09 30.49,54 30.49,52.91 26.29,48.71 v1(26.29,48.66)
  Top Layer w0.254: v1(24.64,47.01) 24.64,46.75 24.6,46.72 24.6,45.7 22.06,43.16 6.19,43.16 5.28,42.25 5.28,33.13 5.66,32.75 5.66,27.07 7.57,25.16 9.09,25.16 9.88,25.95 U7.11
  Bottom Layer w0.254: v1(26.29,48.66) v1(24.64,47.01)
LOADCELL_DATA: length 92
  Top Layer w0.178: v1(26.82,48.11) 26.82,48.42 26.84,48.43 26.84,48.86 30.77,52.79 30.77,53.88 36.86,59.97 36.86,76.82 37.18,77.14 37.2,77.14 37.35,77.3 37.35,87.23 32.03,92.55 U1.28
  Top Layer w0.254: v1(25.19,46.48) 24.99,46.28 24.99,45.59 22.21,42.8 8.4,42.8 5.64,40.04 5.64,33.28 8.93,29.99 9.91,29.99 11.15,28.74 U7.12
  Bottom Layer w0.254: v1(26.82,48.11) v1(25.19,46.48)
OLED_SCL: length 83
  Top Layer w0.178: v1(57.38,36.17) 56.02,37.53 v1(52.71,37.53) ; v1(52.71,38.98) 52.44,38.71 45.18,38.71 38.23,45.67 38.23,89.96 34.05,94.14 34.05,95.41 33.62,95.84 U1.32 ; R29.1 58.41,33.74 v1(57.4,34.75)
  Top Layer w0.254: R29.1 58.41,30.5 OLED1.3
  Bottom Layer w0.178: v1(57.38,36.17) 57.38,34.77 v1(57.4,34.75) ; v1(52.71,38.98) v1(52.71,37.53)
OLED_SDA: length 85.4
  Top Layer w0.178: U1.31 33.57,95.44 33.77,95.24 33.77,94.44 33.64,94.31 33.64,94.02 37.91,89.75 37.91,76.86 37.95,76.82 37.95,76.37 37.91,76.33 37.91,45.59 45.06,38.43 57.01,38.43 57.28,38.7 v1(58.17,38.7)
  Top Layer w0.254: OLED1.4 60.96,33.41 R28.1 60.97,33.92 v1(59.56,35.32) ; v1(58.17,37.53) 58.14,37.5 v1(58.14,36.17)
  Bottom Layer w0.254: v1(58.14,36.17) 58.99,35.32 v1(59.56,35.32) ; v1(58.17,38.7) v1(58.17,37.53)
PWR_PS: length 117.3
  Top Layer w0.178: U1.17 27.63,92.76 24.87,90 v1(24.87,88.79) ; v1(15.29,88.79) 14.92,88.79 10.49,93.22 10.49,96.59 9.78,97.3 9.78,104.66 9.8,104.66 17.61,112.48 17.61,114.02 18.05,114.46 25.32,114.46 v1(30.38,119.52) ; v1(22.95,88.79) 22.73,88.57 16.93,88.57 v1(16.71,88.79)
  Top Layer w0.254: v1(16.89,126.51) 17.41,125.99 U8.7 ; 15,127.65 v1(15.67,127.65) 15.67,127.78 19.51,131.61 23.01,131.61 27.83,136.44 34.54,136.44 35.59,135.4 35.59,120.82 34.29,119.52 v1(31.8,119.52) ; 15,127.65 14.99,127.67 R19.2 ; 15,127.65 14.48,127.65 13.23,128.9 12.46,128.9 12.17,129.19 12.06,129.19 v1(12,129.13) ; U10.7 11.75,127.09 v1(12.02,127.37)
  Bottom Layer w0.178: v1(24.87,88.79) v1(22.95,88.79) ; v1(16.71,88.79) v1(15.29,88.79)
  Bottom Layer w0.254: v1(16.89,126.51) 15.75,127.65 v1(15.67,127.65) ; v1(12,129.13) 12,127.39 v1(12.02,127.37) ; v1(31.8,119.52) v1(30.38,119.52)
PWR_SOURCE: length 84
  Top Layer w0.178: v1(22.95,88.03) v1(16.71,88.03) ; v1(4.29,137.58) 3.08,137.58 1.37,135.88 1.37,106.67 7.02,101.01 v1(7.02,96.03) ; v1(24.04,88.03) 24.04,89.57 27.23,92.76 U1.16 ; v1(9.94,96.03) 9.94,93.37 14.75,88.57 14.75,88.56 15.07,88.24 15.08,88.24 v1(15.29,88.03)
  Top Layer w0.254: v1(5.24,136.88) 5.24,136.2 R16.1 5.84,136.03 6.18,135.7 6.18,133.48 6.91,132.75 8.86,132.75 9.01,132.6 U9.8
  Bottom Layer w0.178: v1(16.71,88.03) v1(15.29,88.03) ; v1(9.94,96.03) v1(7.02,96.03) ; v1(24.04,88.03) v1(22.95,88.03)
  Bottom Layer w0.254: v1(5.24,136.88) 4.54,137.58 v1(4.29,137.58)
RESET: length 21
  Top Layer w0.178: U1.26 31.28,93.63 31.28,93.04 31.35,92.98 31.35,91.35 31.35,91.35 31.35,91.22 32.28,90.29 33.44,90.29 36.79,86.94 36.79,78.69 36.74,78.64 35.83,78.64 35.81,78.63 H6.2
RP_SWCLK: length 15.9
  Top Layer w0.178: H5.1 31.37,81.68 33.7,84 33.7,89.08 33.13,89.65 32.02,89.65 30.43,91.25 U1.24
RP_SWD: length 15.4
  Top Layer w0.178: U1.25 30.83,91.35 32.17,90.01 33.32,90.01 36.51,86.82 36.51,82.63 H5.3
RTC_1HZ_INT: length 47.2
  Top Layer w0.178: v1(39.38,79.52) 39.38,94.41 37.16,96.64 U1.34
  Top Layer w0.254: R25.1 21.59,85.65 v1(22.95,87.01) ; v1(36.24,79.52) 35.61,80.15 29.08,80.15 24.04,85.19 v1(24.04,87.01)
  Bottom Layer w0.254: v1(36.24,79.52) 39.24,79.52 ; v1(22.95,87.01) v1(24.04,87.01)
RTC_SCL: length 19.9
  Top Layer w0.178: U13.8 19.05,89.8 19.43,89.42 20.43,89.42 20.86,89.85 20.86,94.4 19.28,95.97 19.28,97.5 19.95,98.18 25.82,98.18 25.88,98.24
  Top Layer w0.254: R26.1 19.03,90.82 U13.8
RTC_SDA: length 17.5
  Top Layer w0.178: R27.1 17.52,96.47 19.69,98.64 25.88,98.64
  Top Layer w0.254: R27.1 19.94,92.85 20.32,92.47 U13.7
UART_RX: length 11.5
  Top Layer w0.178: H4.1 17.59,97.04 19.56,99.02 25.85,99.02 25.88,99.04
UART_TX: length 11.7
  Top Layer w0.178: H4.3 16.73,102.12 19.41,99.44 25.88,99.44
USB_DM: length 69.8
  Top Layer w0.254: U6.B7 10.02,138.02 10.22,137.82 10.22,137.34 10.02,137.14 10.02,136.32 ; 10.02,136.32 10.1,136.25 10.1,136.23 11.28,135.05 11.28,132.98 11.46,132.8 22.3,132.8 27.92,138.42 34.56,138.42 37.44,135.54 37.44,111.73 33.45,107.74 33.45,107.49 33.78,107.16 33.78,106.62 ; 10.02,136.32 9.04,137.3 9.04,138.77 U6.A7
USB_DP: length 70.1
  Top Layer w0.254: v1(9.64,137.58) 9.52,137.69 U6.A6 ; U6.B6 8.52,137.29 9.83,135.98 9.85,135.98 10.92,134.9 10.92,132.84 11.31,132.45 22.45,132.45 28.07,138.06 34.42,138.06 37.08,135.4 37.08,111.88 33.1,107.89 33.1,107.49 32.77,107.16 32.77,106.62
  Bottom Layer w0.254: v1(8.11,137.61) 8.13,137.58 v1(9.64,137.58)
VSRC: length 38.2
  Top Layer w0.254: U9.7 8.51,131.46 ; 17.91,127.9 17.9,127.89 U8.6 ; U8.5 20.71,126.76 ; U8.8 17.27,125.49 ; U10.8 11.25,127.09 ; U9.2 8.51,134 ; U10.5 12.52,123.58
  Top Layer w0.508: 11.21,128.42 10.58,127.78 C9.1 9.92,130.05 ; 11.21,128.42 11.25,128.38 11.25,127.09 ; 11.21,128.42 13.03,128.42 13.66,127.78 ; 9.92,130.05 9.92,132.75 10.24,133.07 10.24,133.66 9.92,133.98 9.92,133.99 9.78,134.13 8.62,134.13 ; 9.92,130.05 8.64,131.33 ; 16.13,125.49 16.13,125.32 14.99,126.45 ; 16.13,125.49 17.27,125.49 ; 16.13,125.49 16.13,127.02 17.02,127.9 20.07,127.9 20.71,127.26 20.71,126.76 ; 14.99,126.45 13.66,127.78 ; 14.99,126.45 14.99,126.44 C8.1 ; 13.66,127.78 13.66,124.1 13.14,123.58 12.52,123.58
$1N2063: length 24.9
  Top Layer w0.508: LED1.4 70.09,141.37 LED2.2
$1N2139: length 28.7
  Top Layer w0.508: LED4.2 110.7,90.96 110.7,91.28 110.34,91.64 110.34,103.66 101.33,112.67 LED3.4
$1N2145: length 26.3
  Top Layer w0.508: LED2.4 LED3.2
$1N2293: length 23.4
  Top Layer w0.508: LED6.2 87.34,46.57 99.94,59.17 99.94,60.72 LED5.4
$1N2297: length 24.9
  Top Layer w0.508: LED8.2 44.21,36.47 LED7.4
$1N2301: length 22.2
  Top Layer w0.508: LED6.4 76.69,39.77 LED7.2
$1N2449: length 28.5
  Top Layer w0.508: LED10.2 4,84.63 11.42,77.22 11.42,66.53 12.78,65.17 LED9.4
$1N2453: length 26
  Top Layer w0.381: LED12.2 29.4,121.36 24,115.97 15.51,115.97
$1N2457: length 23
  Top Layer w0.508: LED10.4 8.7,110.56 LED11.2
$1N2463: length 27.8
  Top Layer w0.508: LED5.2 105.93,65.17 109.69,68.92 109.69,83.18 LED4.4
$1N2469: length 26.3
  Top Layer w0.508: LED8.4 LED9.2
$2N848: length 7
  Top Layer w0.254: U1.47 30.43,101.59 30.45,101.61 30.45,103.3 31.6,104.45 32.92,104.45 33.1,104.63 33.1,104.89 32.77,105.22 R12.1
$2N853: length 7
  Top Layer w0.254: U1.46 30.83,101.59 30.8,101.61 30.8,103.15 31.75,104.1 33.06,104.1 33.45,104.49 33.45,104.89 33.78,105.22 R13.1
$2N1332: length 5.7
  Top Layer w0.178: U1.21 29.23,90.83 30.57,89.49 30.57,88.53
$2N1336: length 3.3
  Top Layer w0.254: R32.1 C13.1 30.26,86.66 U4.3
$2N1341: length 11.8
  Top Layer w0.178: U4.1 27.65,86.06 27.65,89.49 28.83,90.67 U1.20
  Top Layer w0.254: C12.1 26.54,83.83 26.54,84.95 U4.1 26.59,84.92
$2N1749: length 2.3
  Top Layer w0.254: H3.2 19.83,111.13 R34.2
$2N4132: length 1.4
  Top Layer w0.254: LED16.1 88.01,30.41 R35.2
$2N4619: length 123.4
  Top Layer w0.178: v1(29.94,53.13) 26.26,56.81 26.23,56.81 26.23,77.6 24.51,79.32 24.51,80.62 23.5,81.64 23.5,93.66 21.45,95.7 19.95,95.7 19.56,96.09 19.56,97.39 20.01,97.84 25.88,97.84
  Top Layer w0.254: v1(62.23,38.12) 62.23,37.1 66.8,32.53 85.98,32.53 86.23,32.27 86.23,30.41 LED16.2 ; v1(59.69,38.12) 44.93,38.12 31.02,52.03 v1(31.02,52.06)
  Bottom Layer w0.254: v1(31.02,52.06) v1(29.94,53.13) ; v1(59.69,38.12) v1(62.23,38.12)
$3N482: length 2.2
  Top Layer w0.254: R1.2 7.52,136.88 U6.B5
$3N500: length 4.3
  Top Layer w0.254: U6.A5 10.59,138.72 10.59,138.08 10.92,137.75 10.92,136.29 11.57,135.64 R2.2
$3N1315: length 5.4
  Top Layer w0.254: R15.1 18.42,122.07 18.42,123.46 17.9,123.98 U8.10
  Top Layer w0.508: R14.2 R15.1
$3N1562: length 3.6
  Top Layer w0.254: U8.1 20.71,124.22
  Top Layer w0.508: U12.1 21.72,122.95 21.45,122.69 R14.1 20.71,122.81 20.71,124.22
$3N1650: length 1.7
  Top Layer w0.254: L2.1 22.31,124.99 U8.2
$3N1654: length 2
  Top Layer w0.254: L2.2 21.38,125.99 U8.4
$3N2042: length 5.4
  Top Layer w0.254: R18.1 8.35,126.4 U10.10
  Top Layer w0.508: R17.2 R18.1
$3N2068: length 3.5
  Top Layer w0.254: U10.1 9.98,123.58
  Top Layer w0.508: U11.1 8.46,122.83 8.45,122.84 R17.1 8.56,123.58 9.98,123.58
$3N2075: length 5
  Top Layer w0.254: L3.1 11.3,119.9 10.75,120.46 U10.2
$3N2077: length 6.9
  Top Layer w0.254: U10.4 11.75,122.7 11.93,122.52 14.73,122.52 15.52,121.73 L3.2
$3N3460: length 1.3
  Top Layer w0.381: R30.2 4.26,118.97 LED14.1
$3N3570: length 3
  Top Layer w0.381: R31.2 25.45,123.68 LED15.1
$4N387: length 7.9
  Top Layer w0.254: 21.12,38.59 L1.1
  Top Layer w0.381: H1.4 19.72,41.67 19.72,41.17 C1.1 21.12,37.88 L1.1
$4N408: length 8.7
  Top Layer w0.254: Q1.3 18.37,36.97 16.76,36.97 16.26,36.47 R8.2
  Top Layer w0.381: U7.3 13.69,34.7 R8.2 ; Q1.3 18.39,37.61 18.64,37.86 19.73,37.86 L1.2
$4N509: length 4.3
  Top Layer w0.254: R7.2 6.64,37.68 C3.2 7.34,35.13 U7.8
$4N513: length 4.3
  Top Layer w0.254: U7.7 8.61,35.26 C3.1 8.04,37.68 R6.2
$4N518: length 4.8
  Top Layer w0.381: R6.1 9.49,39.25 H1.2
$4N525: length 4.2
  Top Layer w0.381: R7.1 6.58,39.89 8.36,41.67 H1.1
$4N604: length 5.3
  Top Layer w0.254: U7.4 12.42,34.93 R8.1 R9.2
$4N666: length 2
  Top Layer w0.254: U7.6 C4.2
$4N934: length 3.7
  Top Layer w0.381: R10.1 14.76,24.44 R11.2 14.96,26.25 U7.15
$4N1097: length 3.9
  Top Layer w0.381: U7.2 14.96,34.94 15.21,35.2 17.2,35.2 Q1.1
$5N278: length 29.7
  Top Layer w0.178: v1(14.65,90.23) 14.65,93.41 14.86,93.61 16.48,93.61 16.84,93.26 16.84,90.27 17.3,89.8 18.16,89.8 18.83,89.13 20.96,89.13 21.59,89.77 U13.6
  Top Layer w0.254: BT1.2 19.56,81.42 13.42,87.56 v1(13.42,89.13)
  Bottom Layer w0.254: v1(14.65,90.23) 13.55,89.13 v1(13.42,89.13)

## Copper pours and planes (outline as drawn; the poured copper is in the pictures)
GND on Bottom Layer: 24.77,46.37 0.89,46.37 0.89,145.3 113.54,145.3 113.54,7 24.77,7
GND on Bottom Layer: 0.76,45.86 24.26,45.86 24.26,7 0.76,7

## Text on the board
Document Layer: Copyright 2025 Paul Hampson / This source describes Open Hardware and is licensed under the CERN- / OHL-S v2. / You may redistribute and modify this source and make products using it / under the terms of the CERN-OHL-S v2 / (https://ohwr.org/cern_ohl_s_v2.txt ). / This source is distributed WITHOUT ANY EXPRESS OR IMPLIED / WARRANTY, INCLUDING OF MERCHANTABILITY, SATISFACTORY / QUALITY AND FITNESS FOR A PARTICULAR PURPOSE. Please see / the CERN-OHL-S v2 for applicable conditions. / Source location: https://github.com/paulhampson/smart-coaster-hw / As per CERN-OHL-S v2 section 4, should You produce hardware based / on this source, You must where practicable maintain the Source Location / visible on the external case of the Smart Coaster or other products you make using / this source.
Top Silkscreen Layer: GND | VCC | SCL | SDA | Copyright 2025 Paul Hampson. / The design for this PCB is licensed / under the CERN-OHL-S v2 license. / For full details see the original source at / https://github.com/paulhampson/smart-coaster-hw | 5V PSU | RTC | 3.3V PSU | Smart Coaster Rev 1
